# EasyEDA Pro project 台钳控制板.epro

# Schematic Schematic2
Create Date: 2024-07-13; Page Name: P1; Project Name: 台钳控制板; Schematic Name: Schematic2; Update Date: 2024-07-13; Company: 嘉立创EDA; Page Size: A4; Version: V1.0
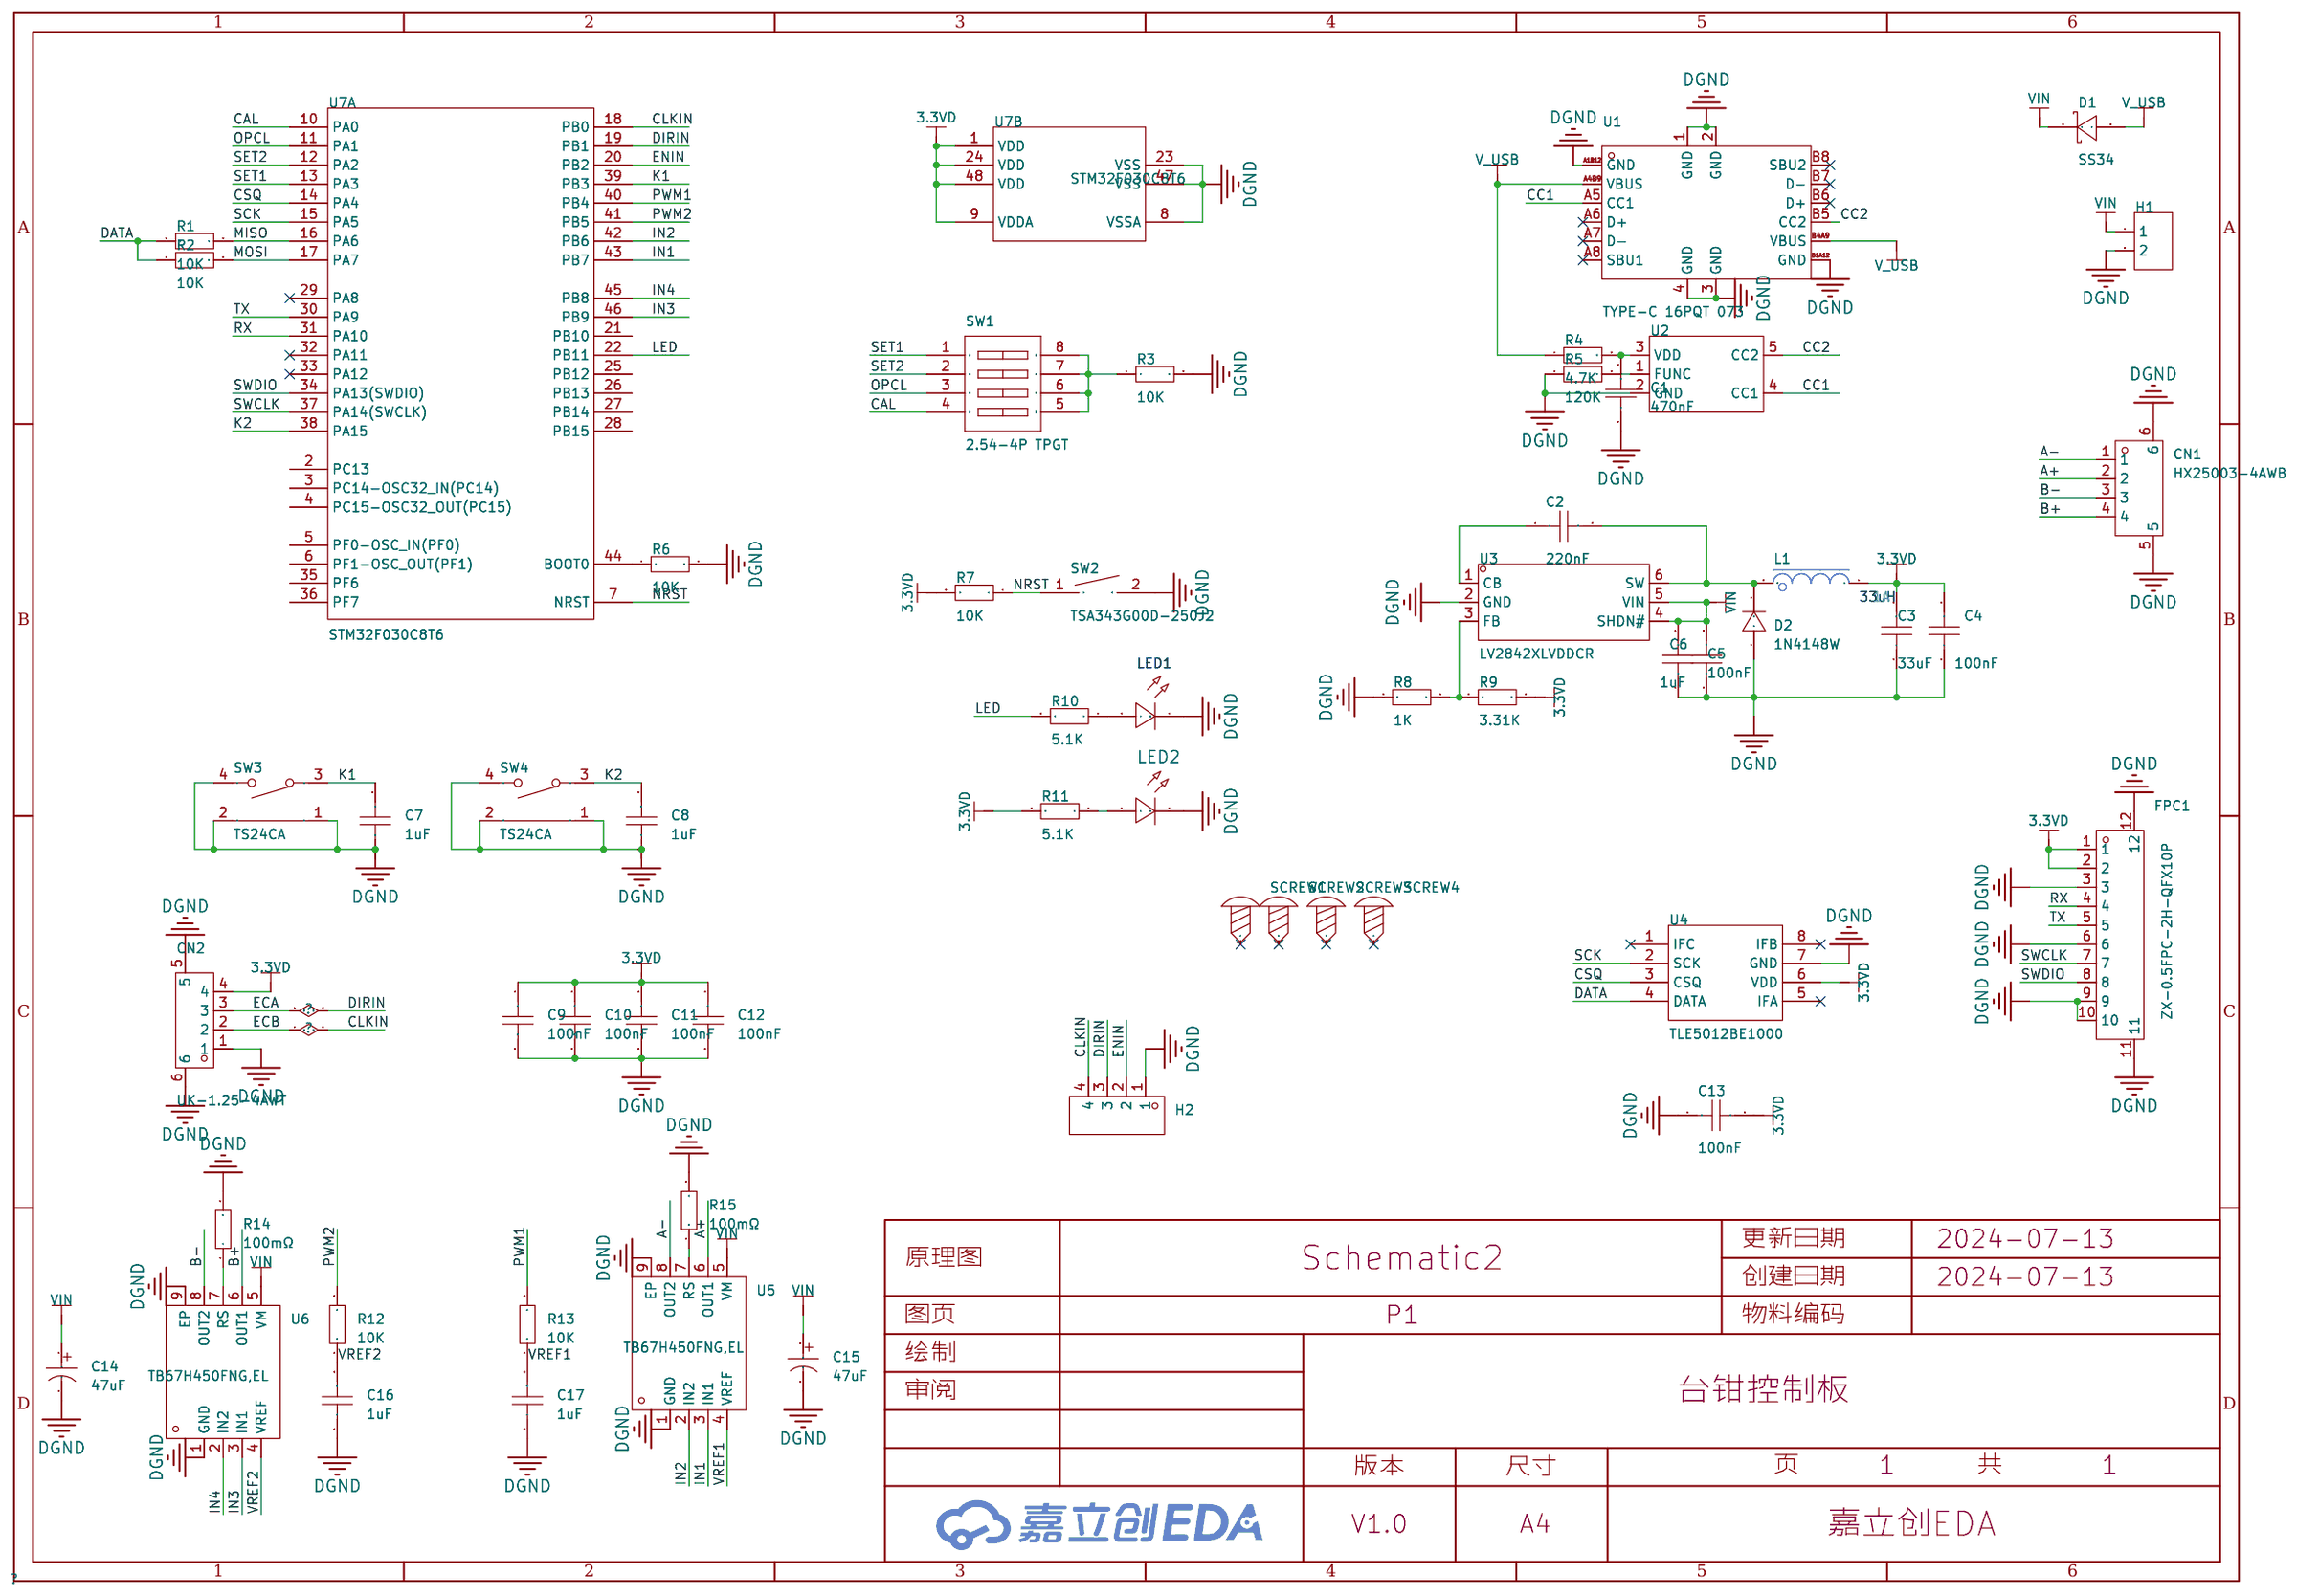
[diagram p0: schematic sheet]

## Parts
C1  470nF  [C0402]
C2  220nF  [C0402]
C3  33uF  [C0603]
C4  100nF  [C0402]
C5  100nF  [C0402]
C6  1uF  [C0603]
C7  1uF  [C0402]
C8  1uF  [C0402]
C9  100nF  [C0402]
C10  100nF  [C0402]
C11  100nF  [C0402]
C12  100nF  [C0402]
C13  100nF  [C0402]
C14  47uF  [CAP-SMD_BD6.3-L6.6-W6.6-FD]
C15  47uF  [CAP-SMD_BD6.3-L6.6-W6.6-FD]
C16  1uF  [C0402]
C17  1uF  [C0402]
CN1  HX25003-4AWB  [CONN-SMD_4P-P2.50_HX25003-4AWB]
CN2  UK-1.25-4AWT  [CONN-SMD_4P-P1.25-HC-1.25-4PWT]
D1  SS34  [SMA_L4.3-W2.6-LS5.2-RD]
D2  1N4148W  [SOD-123F_L2.7-W1.6-LS3.8-RD]
FPC1  ZX-0.5FPC-2H-QFX10P  [FPC-SMD_10P-P0.50_ZX-0.5FPC-2H-QFX10P]
H1  -  [HDR-TH_2P-P2.54-V-F]
H2  -  [HDR-TH_4P-P2.54-V-M]
L1  33uH  [SMD_L_4020]
LED1  -  [LED_0603]
LED2  -  [LED_0603]
R1  10K  [R0402]
R2  10K  [R0402]
R3  10K  [R0402]
R4  4.7K  [R0402]
R5  120K  [R0402]
R6  10K  [R0402]
R7  10K  [R0402]
R8  1K  [R0402]
R9  3.31K  [R0402]
R10  5.1K  [R0402]
R11  5.1K  [R0402]
R12  10K  [R0402]
R13  10K  [R0402]
R14  100mΩ  [R1206]
R15  100mΩ  [R1206]
SCREW1  -  [M3螺丝]
SCREW2  -  [M3螺丝]
SCREW3  -  [M3螺丝]
SCREW4  -  [M3螺丝]
SW1  2.54-4P TPGT  [SW-SMD_8P-L10.2-W6.2-P2.54-LS9.4]
SW2  TSA343G00D-250J2  [SW-SMD_L4.0-W2.9-P4.15-EH]
SW3  TS24CA  [SW-SMD_TS24CA]
SW4  TS24CA  [SW-SMD_TS24CA]
U1  TYPE-C 16PQT 073  [USB-SMD_TYPE-C-16PQT-073]
U2  fs312a  [SOT-23-5_L3.0-W1.7-P0.95-LS2.8-BL]
U3  LV2842XLVDDCR  [SOT-23-6_L2.9-W1.6-P0.95-LS2.8-BR]
U4  TLE5012BE1000  [PG-DSO-8_L5.0-W4.0-P1.27-LS6.0-BL]
U5  TB67H450FNG,EL  [HSOP-8_L5.0-W4.0-P1.27-LS6.2-BL-EP]
U6  TB67H450FNG,EL  [HSOP-8_L5.0-W4.0-P1.27-LS6.2-BL-EP]
U7  STM32F030C8T6  [LQFP-48_L7.0-W7.0-P0.50-LS9.0-BL]  (sections 1,2)

## Library data of the parts
C1 C5 C7-C12 C16 C17 = CAP_0402: Supplier Footprint: 0402
C2-C4 C6 C13 = CAP_0603: Supplier Footprint: 0603
C14 C15 = UWX1C101MCL1GB: 容值:100uF;精度:±20%;额定电压:16V;纹波电流:129mA@10kHz;等效串联电阻:-;; LCSC Part Name: 100uF ±20% 16V; Supplier Part: C111600; Manufacturer: Nichicon(尼吉康); Supplier Footprint: SMD,D6.3xL5.4mm; JLCPCB Part Class: 扩展库; Datasheet: https://atta.szlcsc.com/upload/public/pdf/source/20170511/1494500117761.pdf; Supplier: LCSC; Tolerance: ±20%; Rated Voltage: 16V; Ripple Current: 129mA@10kHz; Lifetime @ Temp: 2000hrs@85℃; Operating Temperature: -40℃~+85℃
CN1 = HX25003-4AWB: 插针结构:1x4P;间距:2.5mm;安装方式:卧贴;参考系列:XH;总PIN数:4P;排数:1;每排PIN数:4;行距:-;额定电流:-;工作温度范围:-;; LCSC Part Name: 1x4P 间距:2.5mm 卧贴 系列:XH; Supplier Part: C442363; Manufacturer: HX(红星); Supplier Footprint: SMD,P=2.5mm,卧贴; JLCPCB Part Class: 扩展库; Datasheet: https://atta.szlcsc.com/upload/public/pdf/source/20191028/C442367_BC69C0AF17F43F9554F3C8F10FEBE7E8.pdf; Supplier: LCSC; Pins Structure: 1x4P; Pitch: 2.5mm; Mounting Style: 卧贴; Reference Series: XH; Number of Pins: 4P; Number of Rows: 1; Number of PINs Per Row: 4
CN2 = UK-1.25-4AWT: 插针结构:1x4P;间距:1.25mm;安装方式:卧贴;总PIN数:4P;排数:1;每排PIN数:4;额定电流:1A;工作温度范围:-25℃~+85℃;; LCSC Part Name: 间距:1.25mm 卧贴; Supplier Part: C2997378; Manufacturer: USAKRO(美韩); Supplier Footprint: SMD,P=1.25mm,卧贴; JLCPCB Part Class: 扩展库; Datasheet: https://atta.szlcsc.com/upload/public/pdf/source/20220419/24A4256629D7E8D61BFE5BCA4B394246.pdf; Supplier: LCSC; Pins Structure: 1x4P; Pitch: 1.25mm; Mounting Style: 卧贴; Number of Pins: 4P; Number of Rows: 1; Number of PINs Per Row: 4; Current Rating (Max): 1A; Operating Temperature Range: -25℃~+85℃
D1 = SS34_C8678: 二极管配置:独立式;正向压降(Vf):550mV@3A;直流反向耐压(Vr):40V;整流电流:3A;; LCSC Part Name: 电压:40V 电流:3A; Supplier Part: C8678; Manufacturer: MDD(辰达半导体); Supplier Footprint: SMA(DO-214AC); JLCPCB Part Class: 基础库; Datasheet: https://atta.szlcsc.com/upload/public/pdf/source/20230314/A80AE34493C69B89E2F4B1712F433538.pdf; Supplier: LCSC; Diode Configuration: 独立式; Forward Voltage (Vf@If): 550mV@3A; Reverse Voltage (Vr): 40V; Rectified Current: 3A; Reverse Leakage Current (Ir): 500uA@40V
D2 = 1N4148W_C81598: 二极管配置:独立式;正向压降(Vf):1V@50mA;直流反向耐压(Vr):75V;平均整流电流(Io):150mA;功率:400mW;反向恢复时间(trr):4ns;; LCSC Part Name: 电压:75V 电流:150mA; Supplier Part: C81598; Manufacturer: ST(先科); Supplier Footprint: SOD-123; JLCPCB Part Class: 基础库; Datasheet: https://atta.szlcsc.com/upload/public/pdf/source/20161024/1477288446905.pdf; Supplier: LCSC; Diode Configuration: 独立式; Forward Voltage (Vf@If): 1V@50mA; Reverse Voltage (Vr): 75V; Average Rectified Current (Io): 150mA; Power Dissipation: 400mW; Reverse Leakage Current: 1uA@75V; Reverse Recovery Time (trr): 4ns
FPC1 = ZX-0.5FPC-2H-QFX10P: 锁定特性:翻盖式;触点类型:下接;触点数量:10P;间距:0.5mm;安装类型:卧贴;工作温度范围:-25℃~+85℃;焊接温度(最大值):260℃;; LCSC Part Name: 间距:0.5mm P数:10P 翻盖式 下接; Supplier Part: C19191099; Manufacturer: Megastar(兆星); Supplier Footprint: SMD,P=0.5mm,卧贴; JLCPCB Part Class: Extended Part; Datasheet: https://atta.szlcsc.com/upload/public/pdf/source/20231122/FDEF65B08E48FE17C134EB18CD9A6E22.pdf; Supplier: LCSC; Locking Feature: 翻盖式; Contact Type: 下接; Number of Contacts: 10P; Pitch: 0.5mm; Mounting Type: 卧贴; FFC, FCB Thickness: 0.3mm; Height Above Board: 2mm; Contact Material: 铜合金; Contact Plating: 锡; Operating Temperature Range: -25℃~+85℃; Soldering Temperature(Max): 260℃
H1 = HDR-F_2.54_1x2P: Supplier Part: C49661; Supplier Footprint: 插件
H2 = HDR-M_2.54_1x4P: Supplier Part: C492403; Supplier Footprint: 插件
L1 = L-4.7uH-1A: 4.7uH-1A-SNR4020B; 额定电流: 1A; Inductance: 4.7uH; 直流电阻（DCR）: 0.098Ω; 精度: ±20%; Datasheet: 新SWPA_series_of_SMD_Power_Inductor___奕锋泰; Part Code: L-SMD-4020-00002; Supplier Part: C7589004
LED1 = LED_0603-G: Supplier Footprint: 0603
LED2 = LED_0603-R: Supplier Footprint: 0603
R1 R2 = Res_0402: Supplier Footprint: 0402
R3-R13 = Res_0603: Supplier Footprint: 0603
R14 R15 = 1206W4F100LT5E: 电阻类型:厚膜电阻;阻值:100mΩ;精度:±1%;功率:250mW;最大工作电压:200V;温度系数:±800ppm/℃;; LCSC Part Name: 100mΩ ±1% 250mW 厚膜电阻; Supplier Part: C25334; Manufacturer: UNI-ROYAL(厚声); Supplier Footprint: 1206; JLCPCB Part Class: 基础库; Datasheet: https://atta.szlcsc.com/upload/public/pdf/source/20200306/C422600_1E6D84923E4A46A82E41ADD87F860B5C.pdf; Supplier: LCSC; Type: 厚膜电阻; Tolerance: ±1%; Power(Watts): 250mW; Overload Voltage (Max): 200V; Temperature Coefficient: ±800ppm/℃; Operating Temperature Range: -55℃~+155℃
SCREW1-SCREW4 = M3螺丝: Supplier Footprint: 插件
SW1 = 2.54-4P TPGT: 类型:平拨,凸起式;电路结构:单刀单掷;开关位数:4位;额定电流:25mA;额定电压:24V;使用寿命:3千次;颜色:黑色;; LCSC Part Name: 间距2.54mm 4位高推 拨码开关 贴片; Supplier Part: C6331176; Manufacturer: SHOU HAN(首韩); Supplier Footprint: SMD; JLCPCB Part Class: 扩展库; Datasheet: https://atta.szlcsc.com/upload/public/pdf/source/20240424/C829D75C35A7F665042EE0237C58A657.pdf; Supplier: LCSC; Type: 平拨,凸起式; Circuit: 单刀单掷; Number of Positions: 4位; Lead Pitch: 2.54mm; Current Rating: 25mA; Voltage Rating: 24V; Operating Life: 3千次; Color: 黑色
SW2 = TSA343G00D-250J2: 电路结构:单刀单掷;按钮形状:圆形按钮;作用力:250gf;安装方式:立贴;开关长度:4mm;开关宽度:3mm;开关高度:2mm;带支架:不带;触点电流:50mA;额定电压(DC):12V;绝缘电阻:100MΩ;带灯:无;机械寿命:5万次;; LCSC Part Name: 4*3*2mm 立贴 轻触开关; Supplier Part: C354947; Manufacturer: BRIGHT(博瑞泰); Supplier Footprint: SMD; JLCPCB Part Class: 扩展库; Datasheet: https://atta.szlcsc.com/upload/public/pdf/source/20190426/C354947_F1C4B323DD8D3B81255E73F8FD6ABFD3.pdf; Supplier: LCSC; Circuit: 单刀单掷; Actuator Style: 圆形按钮; Operating Force: 250gf; Mounting Style: 立贴; Switch Length: 4mm; Switch Width: 3mm; Switch Height: 2mm; Strike Gundam: 不带; Contact Current: 50mA; Voltage Rating (DC): 12V; Insulation Resistance: 100MΩ; Actuator/Cap Color: 黑色; With Lamp: 无; Pin Style: SMD接片; Mechanical Life: 5万次; Operating Temperature: -25℃~+70℃
SW3 SW4 = TS24CA: 电路结构:单刀单掷;按钮形状:矩形按钮;安装方式:卧贴;开关长度:4.55mm;开关宽度:1.8mm;开关高度:3.5mm;触点电流:50mA;额定电压(DC):12V;带灯:-;机械寿命:-;; LCSC Part Name: 4.55*1.8*3.5mm 卧贴 轻触开关; Supplier Part: C393942; Manufacturer: SHOU HAN(首韩); Supplier Footprint: SMD; JLCPCB Part Class: 扩展库; Datasheet: https://atta.szlcsc.com/upload/public/pdf/source/20190521/C393942_591A9E318887EFA4274D34029981AD99.pdf; Supplier: LCSC; Circuit: 单刀单掷; Actuator Style: 矩形按钮; Mounting Style: 卧贴; Switch Length: 4.55mm; Switch Width: 1.8mm; Switch Height: 3.5mm; Contact Current: 50mA; Voltage Rating (DC): 12V
U1 = TYPE-C 16PQT 073: 连接器类型:Type-C;标准:-;公母:母;端口数量:1;触点数量:16P;安装方式:卧贴;额定电流 - 电源:3A;触头材质:-;触头镀层:-;工作温度范围:-25℃~+85℃;; LCSC Part Name: Type-C 母 卧贴; Supplier Part: C5156603; Manufacturer: SHOU HAN(首韩); Supplier Footprint: SMD; JLCPCB Part Class: 扩展库; Datasheet: https://atta.szlcsc.com/upload/public/pdf/source/20220905/90688BCC0A20F79F4C7CA977EA1B0A11.pdf; Supplier: LCSC; Connector Type: Type-C; Gender: 母; Number of Ports: 1; Number of Contacts: 16P; Mounting Style: 卧贴; Current Rating - Power (Max): 3A; Operating Temperature Range: -25℃~+85℃
U2 = FS312A: Supplier: LCSC; Supplier Part: C9900044546; Supplier Footprint: SOT23-5; Datasheet: http://43.138.174.208/wp-content/uploads/2022/11/%E9%80%9F%E8%8A%AF%E5%BE%AE%E7%94%B5%E5%AD%90FS312A%E6%95%B0%E6%8D%AE%E6%89%8B%E5%86%8C-v1.2%EF%BC%882022.11.7%EF%BC%89.pdf
U3 = LV2842XLVDDCR: 功能类型:降压型;输入电压:-;输出电流(最大值):-;; Supplier Part: C225807; Manufacturer: TI(德州仪器); Supplier Footprint: SOT-23-6; JLCPCB Part Class: 扩展库; Datasheet: https://atta.szlcsc.com/upload/public/pdf/source/20180820/C225807_86EBD6310E0F8BF9D1D4E9854A4EDCFD.pdf; Supplier: LCSC; Function: 降压型; Switch tube (built-in/external): 内置
U4 = TLE5012BE1000: 旋转角度范围:0°~360°;; Supplier Part: C123083; Manufacturer: Infineon(英飞凌); Supplier Footprint: SO-8; JLCPCB Part Class: 扩展库; Datasheet: https://atta.szlcsc.com/upload/public/pdf/source/20170728/C123083_1501225763065848823.pdf; Supplier: LCSC; Rotation Angle: 0°~360°
U5 U6 = TB67H450FNG,EL: Supplier Part: C545417; Manufacturer: TOSHIBA(东芝); Supplier Footprint: SOIC-8; JLCPCB Part Class: 扩展库; Datasheet: https://atta.szlcsc.com/upload/public/pdf/source/20211227/C3DC112555A020FEF41243C8668D1DC3.pdf; Supplier: LCSC
U7 = STM32F030C8T6: CPU内核:CM0;程序存储容量:64KB;RAM总容量:8KB;GPIO端口数量:39;工作电压范围:2.4V~3.6V;CPU最大主频:48MHz;程序存储器类型:FLASH;; LCSC Part Name: 基于ARM®的32位MCU，具有高达256KB的闪存，定时器，ADC，通信接口，2.4V-3.6V操作; Supplier Part: C23922; Manufacturer: ST(意法半导体); Supplier Footprint: LQFP-48(7x7); JLCPCB Part Class: 扩展库; Datasheet: https://atta.szlcsc.com/upload/public/pdf/source/20150124/1457707258011.pdf; Supplier: LCSC; CPU Core: CM0; Program Storage Size: 64KB; RAM Size: 8KB; GPIO Ports Number: 39; Operating Voltage Range: 2.4V~3.6V; CPU Maximum Speed: 48MHz; Program Memory Type: FLASH; Operating Temperature Range: -40℃~+85℃; ADC (Bit): 12bit; Watchdog: 有; Low-Voltage Detect: 有; Direct Memory Access: 有; Internal Oscillator: 有

## Nets
3.3VD: C3.2 C4.2 C9.1 C10.1 C11.1 C12.1 C13.2 CN2.4 FPC1.1 FPC1.2 L1.1 R7.2 R9.1 R11.2 U4.6(VDD) U7.1(VDD) U7.9(VDDA) U7.24(VDD) U7.48(VDD)
DGND: C1.1 C3.1 C4.1 C5.1 C6.1 C7.1 C8.1 C9.2 C10.2 C11.2 C12.2 C13.1 C14.2 C15.2 C16.1 C17.1 CN1.5 CN1.6 CN2.1 CN2.5 CN2.6 D2.2(A) FPC1.3 FPC1.6 FPC1.9 FPC1.10 FPC1.11 FPC1.12 H1.2 H2.1 LED1.1(C) LED2.1(C) R3.2 R5.1 R6.2 R8.2 R14.2 R15.2 SW2.2 SW3.1 SW3.2 SW3.4 SW4.1 SW4.2 SW4.4 U1.1(GND) U1.2(GND) U1.3(GND) U1.4(GND) U1.A1B12(GND) U1.B1A12(GND) U2.2(GND) U3.2(GND) U4.7(GND) U5.1(GND) U5.9(EP) U6.1(GND) U6.9(EP) U7.8(VSSA) U7.23(VSS) U7.47(VSS)
VIN: C5.2 C6.2 C14.1 C15.1 D1.1(K) H1.1 U3.4(SHDN#) U3.5(VIN) U5.5(VM) U6.5(VM)
A+: CN1.2 U5.6(OUT1)
A-: CN1.1 U5.8(OUT2)
B+: CN1.4 U6.6(OUT1)
B-: CN1.3 U6.8(OUT2)
CAL: SW1.4(A4) U7.10(PA0)
CC1: U1.A5(CC1) U2.4(CC1)
CC2: U1.B5(CC2) U2.5(CC2)
CLKIN: CN2.2 H2.4 U7.18(PB0)
CSQ: U4.3(CSQ) U7.14(PA4)
DATA: R1.1 R2.1 U4.4(DATA)
DIRIN: CN2.3 H2.3 U7.19(PB1)
ENIN: H2.2 U7.20(PB2)
IN1: U5.3(IN1) U7.43(PB7)
IN2: U5.2(IN2) U7.42(PB6)
IN3: U6.3(IN1) U7.46(PB9)
IN4: U6.2(IN2) U7.45(PB8)
K1: C7.2 SW3.3 U7.39(PB3)
K2: C8.2 SW4.3 U7.38(PA15)
LED: R10.2 U7.22(PB11)
MISO: R1.2 U7.16(PA6)
MOSI: R2.2 U7.17(PA7)
NRST: R7.1 SW2.1 U7.7(NRST)
OPCL: SW1.3(A3) U7.11(PA1)
PWM1: R13.2 U7.40(PB4)
PWM2: R12.2 U7.41(PB5)
RX: FPC1.4 U7.31(PA10)
SCK: U4.2(SCK) U7.15(PA5)
SET1: SW1.1(A1) U7.13(PA3)
SET2: SW1.2(A2) U7.12(PA2)
SWCLK: FPC1.7 U7.37(PA14(SWCLK))
SWDIO: FPC1.8 U7.34(PA13(SWDIO))
TX: FPC1.5 U7.30(PA9)
V_USB: D1.2(A) R4.1 U1.A4B9(VBUS) U1.B4A9(VBUS)
VREF1: C17.2 R13.1 U5.4(VREF)
VREF2: C16.2 R12.1 U6.4(VREF)
$1N1812: R6.1 U7.44(BOOT0)
$1N2583: R3.1 SW1.5(B4) SW1.6(B3) SW1.7(B2) SW1.8(B1)
$1N3189: C1.2 R4.2 U2.3(VDD)
$1N3458: R5.2 U2.1(FUNC)
$1N3955: C2.1 U3.1(CB)
$1N3959: C2.2 D2.1(K) L1.2 U3.6(SW)
$1N4403: R8.1 R9.2 U3.3(FB)
$1N5172: LED2.2(A) R11.1
$1N5198: LED1.2(A) R10.1
$1N7717: R14.1 U6.7(RS)
$1N7720: R15.1 U5.7(RS)

Not connected (* = marked no-connect by the designer): SCREW1 1*; SCREW2 1*; SCREW3 1*; SCREW4 1*; U1 A6(D+)* A7(D-)* A8(SBU1)* B6(D+)* B7(D-)* B8(SBU2)*; U4 1(IFC)* 5(IFA)* 8(IFB)*; U7 2(PC13) 3(PC14-OSC32_IN(PC14)) 4(PC15-OSC32_OUT(PC15)) 5(PF0-OSC_IN(PF0)) 6(PF1-OSC_OUT(PF1)) 21(PB10) 25(PB12) 26(PB13) 27(PB14) 28(PB15) 29(PA8)* 32(PA11)* 33(PA12)* 35(PF6) 36(PF7)

# Schematic Schematic1
Create Date: 2024-04-29; Page Name: P1; Project Name: 台钳控制板; Schematic Name: Schematic1; Update Date: 2024-04-29; Company: 嘉立创EDA; Page Size: A4; Version: V1.0
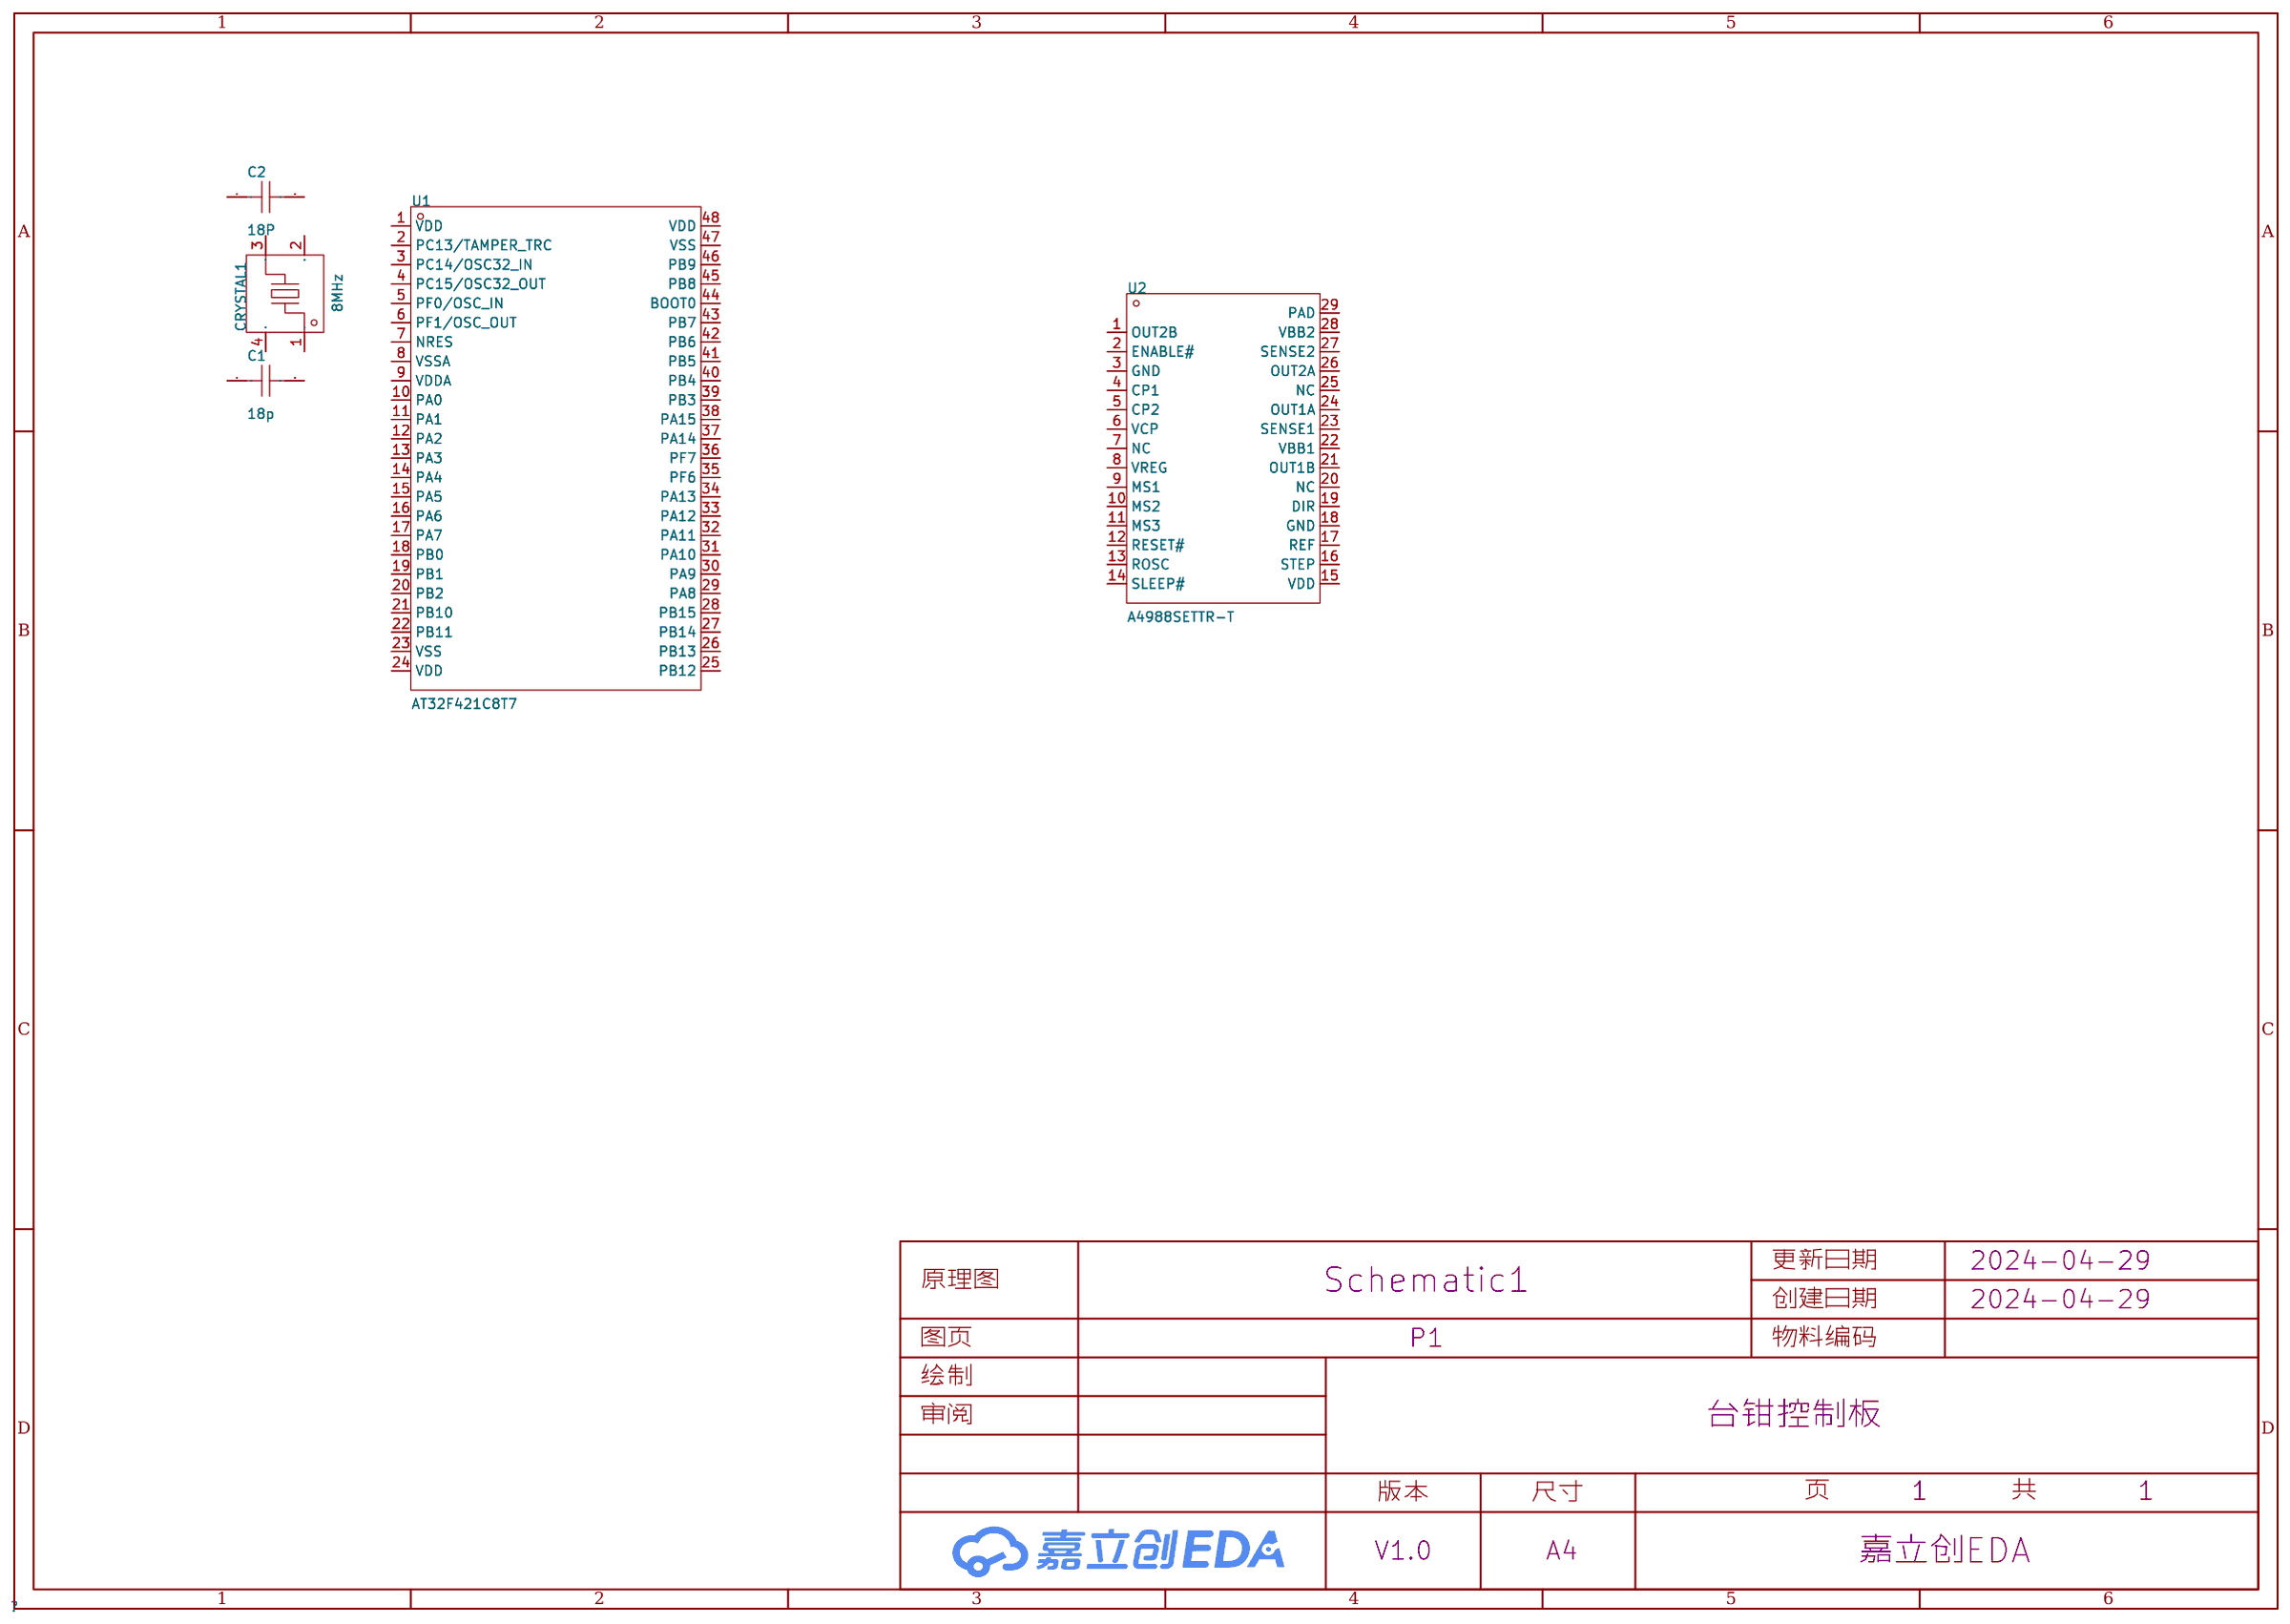
[diagram p1: schematic sheet]

## Parts
C1  18p  [C0603]
C2  18P  [C0603]
CRYSTAL1  8MHz  [CRYSTAL-SMD_4P-L3.2-W2.5-BL_SIT8008BI]
U1  AT32F421C8T7  [LQFP-48_L7.0-W7.0-P0.50-LS9.0-BL]
U2  A4988SETTR-T  [WQFN-28_L5.0-W5.0-P0.50-BL-EP3.2]

## Library data of the parts
C1 C2 = CAP_0603: Supplier Footprint: 0603
CRYSTAL1 = CF4008M00012001: 晶振类型:贴片晶振;频率:8MHz;常温频差:±10ppm;外接负载电容:12pF;频率稳定度(全温):±30ppm;; LCSC Part Name: 8MHz ±10ppm 12pF; Supplier Part: C7294546; Manufacturer: HUAXIN(华昕); Supplier Footprint: SMD-3225-4P; JLCPCB Part Class: 扩展库; Datasheet: https://atta.szlcsc.com/upload/public/pdf/source/20230614/403FD538918E19EFAFACD07D4A487DFF.pdf; Supplier: LCSC; Crystal Type: 贴片晶振; Normal temperature Frequency Tolerance: ±10ppm; External load capacitor: 12pF; Frequency Stability(Full temperature range): ±30ppm; Equivalent Series Resistance (ESR): 40Ω; Operating Temperature: -40℃~+85℃
U1 = AT32F421C8T7: CPU内核:CM4;程序存储容量:64KB;RAM总容量:16KB;GPIO端口数量:-;工作电压范围:-;CPU最大主频:-;程序存储器类型:FLASH;; Supplier Part: C2687447; Manufacturer: ARTERY(雅特力); Supplier Footprint: LQFP-48(7x7); JLCPCB Part Class: 扩展库; Datasheet: https://atta.szlcsc.com/upload/public/pdf/source/20210622/C2765098_2C72C7B1BCEA7473D7B0BCEAEE10BC9B.pdf; Supplier: LCSC; CPU Core: CM4; Program Storage Size: 64KB; RAM Size: 16KB; Program Memory Type: FLASH; Internal Oscillator: 有
U2 = A4988SETTR-T: 驱动电机类型:-;电源电压:3V~5.5V;输出电流:2A;接口:-;; LCSC Part Name: 2A 5.5V电机驱动芯片; Supplier Part: C38437; Manufacturer: ALLEGRO(美国埃戈罗); Supplier Footprint: WQFN-28-EP(5x5); JLCPCB Part Class: 扩展库; Datasheet: https://atta.szlcsc.com/upload/public/pdf/source/20150917/1457707386953.pdf; Supplier: LCSC; Supply Voltage: 3V~5.5V; Output Current: 2A; Operating Temperature: -20℃~+150℃@(Tj)

## Nets

Not connected (* = marked no-connect by the designer): C1 1 2; C2 1 2; CRYSTAL1 1 2(GND) 3 4(GND); U1 1(VDD) 2(PC13/TAMPER_TRC) 3(PC14/OSC32_IN) 4(PC15/OSC32_OUT) 5(PF0/OSC_IN) 6(PF1/OSC_OUT) 7(NRES) 8(VSSA) 9(VDDA) 10(PA0) 11(PA1) 12(PA2) 13(PA3) 14(PA4) 15(PA5) 16(PA6) 17(PA7) 18(PB0) 19(PB1) 20(PB2) 21(PB10) 22(PB11) 23(VSS) 24(VDD) 25(PB12) 26(PB13) 27(PB14) 28(PB15) 29(PA8) 30(PA9) 31(PA10) 32(PA11) 33(PA12) 34(PA13) 35(PF6) 36(PF7) 37(PA14) 38(PA15) 39(PB3) 40(PB4) 41(PB5) 42(PB6) 43(PB7) 44(BOOT0) 45(PB8) 46(PB9) 47(VSS) 48(VDD); U2 1(OUT2B) 2(ENABLE#) 3(GND) 4(CP1) 5(CP2) 6(VCP) 7(NC) 8(VREG) 9(MS1) 10(MS2) 11(MS3) 12(RESET#) 13(ROSC) 14(SLEEP#) 15(VDD) 16(STEP) 17(REF) 18(GND) 19(DIR) 20(NC) 21(OUT1B) 22(VBB1) 23(SENSE1) 24(OUT1A) 25(NC) 26(OUT2A) 27(SENSE2) 28(VBB2) 29(PAD)

# Board PCB1
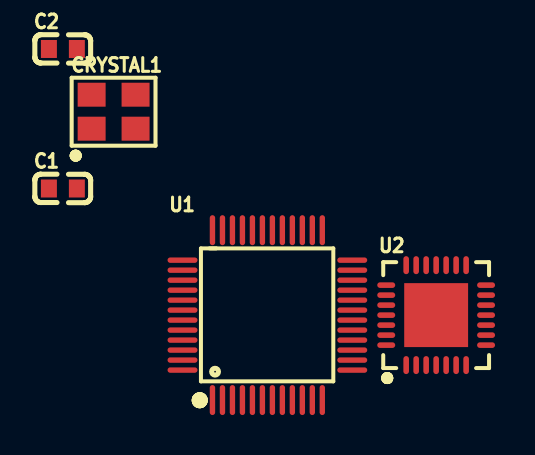
[diagram p2: board, top side]
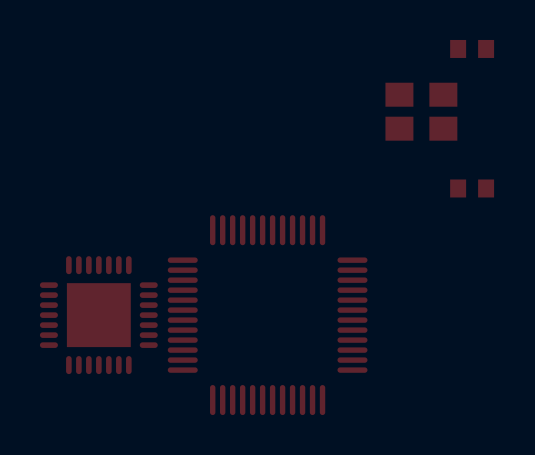
[diagram p3: board, bottom side, seen from below]

No outline. copper layers: Top Layer, Bottom Layer. Coordinates in mm from the lowest, leftmost part position.
Stack: Top Layer 0.035mm / Dielectric1 1.51mm FR4 er 4.5 / Bottom Layer 0.035mm

## Design rules (mm)
template: JLCPCB Capability(Two Layers Board)
spacing copperThickness1oz (default): track to track 0.102, other pairs 0.152 to 0.3
spacing copperThickness2oz: track to track 0.203, other pairs 0.152 to 0.3
track width copperThickness1oz (default): min 0.127, default 0.254, max 2.54
track width copperThickness2oz: min 0.203, default 0.254, max 2.54
differential pair differentialPair (default): width min 0.127, default 0.254, max 2.54; gap min 0.152, default 0.152
via viaSize (default): diameter min 0.5, default 0.61, max 10; hole min 0.3, default 0.305, max 6.3

## Placement (name value [footprint] x y rotation side)
C1  18p  [C0603]  0 6.34 0 top
C2  18P  [C0603]  0 13.32 0 top
CRYSTAL1  8MHz  [CRYSTAL-SMD_4P-L3.2-W2.5-BL_SIT8008BI]  2.54 10.18 0 top
U1  AT32F421C8T7  [LQFP-48_L7.0-W7.0-P0.50-LS9.0-BL]  10.24 0 0 top
U2  A4988SETTR-T  [WQFN-28_L5.0-W5.0-P0.50-BL-EP3.2]  18.69 0 0 top

## Footprints (pads in the part's own frame, mm; a bottom-side part is the same pattern mirrored in y, then rotated)
C0603
  rect 0.8x0.9 smd: 1(-0.7,0) 2(0.7,0)
CRYSTAL-SMD_4P-L3.2-W2.5-BL_SIT8008BI
  rect 1.4x1.2 smd: 1(-1.1,-0.85) 2(1.1,-0.85) 3(1.1,0.85) 4(-1.1,0.85)
LQFP-48_L7.0-W7.0-P0.50-LS9.0-BL
  oval 0.27x1.5 smd: 1(-2.75,-4.25) 2(-2.25,-4.25) 3(-1.75,-4.25) 4(-1.25,-4.25) 5(-0.75,-4.25) 6(-0.25,-4.25) 7(0.25,-4.25) 8(0.75,-4.25) 9(1.25,-4.25) 10(1.75,-4.25) 11(2.25,-4.25) 12(2.75,-4.25) 25(2.75,4.25) 26(2.25,4.25) 27(1.75,4.25) 28(1.25,4.25) 29(0.75,4.25) 30(0.25,4.25) 31(-0.25,4.25) 32(-0.75,4.25) 33(-1.25,4.25) 34(-1.75,4.25) 35(-2.25,4.25) 36(-2.75,4.25)
  oval 1.5x0.27 smd: 13(4.25,-2.75) 14(4.25,-2.25) 15(4.25,-1.75) 16(4.25,-1.25) 17(4.25,-0.75) 18(4.25,-0.25) 19(4.25,0.25) 20(4.25,0.75) 21(4.25,1.25) 22(4.25,1.75) 23(4.25,2.25) 24(4.25,2.75) 37(-4.25,2.75) 38(-4.25,2.25) 39(-4.25,1.75) 40(-4.25,1.25) 41(-4.25,0.75) 42(-4.25,0.25) 43(-4.25,-0.25) 44(-4.25,-0.75) 45(-4.25,-1.25) 46(-4.25,-1.75) 47(-4.25,-2.25) 48(-4.25,-2.75)
WQFN-28_L5.0-W5.0-P0.50-BL-EP3.2
  oval 0.28x0.9 smd: 1(-1.502,-2.5) 2(-1.001,-2.5) 3(-0.5,-2.5) 4(0,-2.5) 5(0.5,-2.5) 6(1,-2.5) 7(1.501,-2.5) 15(1.501,2.5) 16(1,2.5) 17(0.5,2.5) 18(0,2.5) 19(-0.5,2.5) 20(-1.001,2.5) 21(-1.502,2.5)
  oval 0.9x0.28 smd: 8(2.5,-1.502) 9(2.5,-1.001) 10(2.5,-0.5) 11(2.5,0) 12(2.5,0.5) 13(2.5,1) 14(2.5,1.501) 22(-2.5,1.501) 23(-2.5,1) 24(-2.5,0.5) 25(-2.5,0) 26(-2.5,-0.5) 27(-2.5,-1.001) 28(-2.5,-1.502)
  rect 3.2x3.2 smd: 29(0,0)

## Nets
As in the schematic.

Pads without a net: C1 1 2; C2 1 2; CRYSTAL1 1 2 3 4; U1 1 2 3 4 5 6 7 8 9 10 11 12 13 14 15 16 17 18 19 20 21 22 23 24 25 26 27 28 29 30 31 32 33 34 35 36 37 38 39 40 41 42 43 44 45 46 47 48; U2 1 2 3 4 5 6 7 8 9 10 11 12 13 14 15 16 17 18 19 20 21 22 23 24 25 26 27 28 29

# Board PCB2
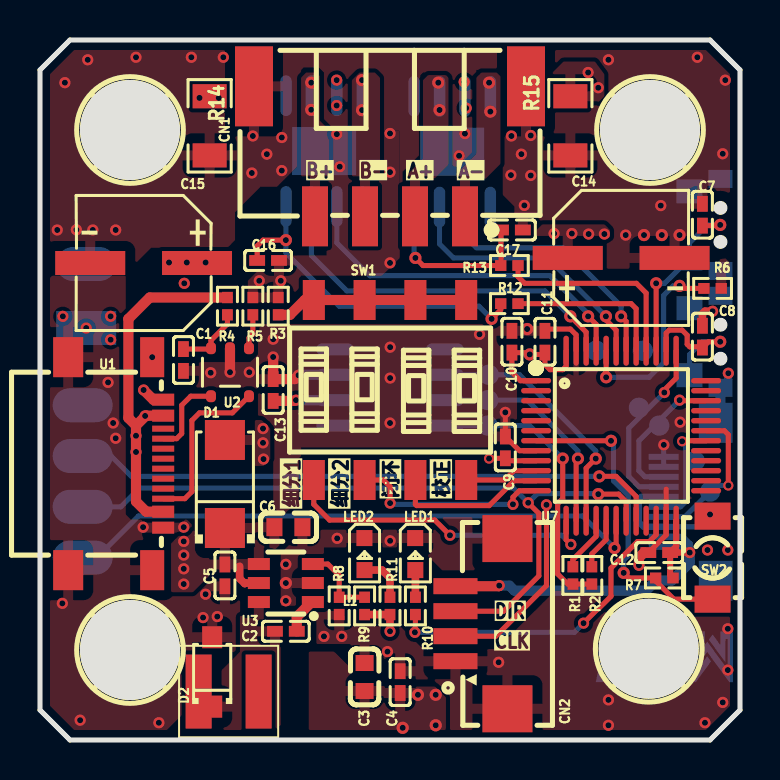
[diagram p4: board, top side]
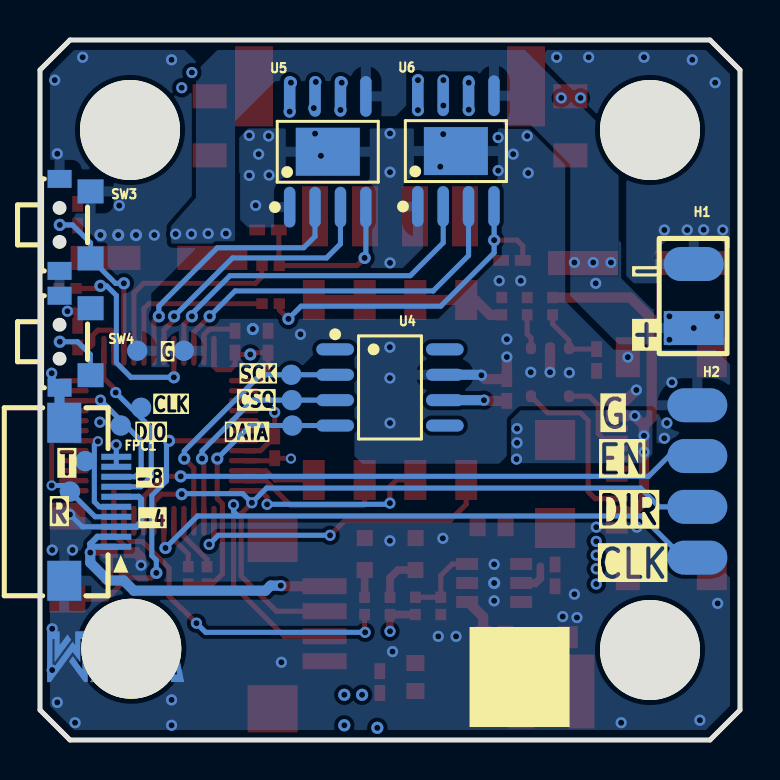
[diagram p5: board, bottom side, seen from below]

Outline 35 x 35 mm; copper layers: Top Layer, Inner1, Inner2, Bottom Layer. Coordinates in mm from the lower left corner of the outline.
Outline path: 0,33.5 0,1.5 1.5,0 33.5,0 35,1.5 35,33.5 33.5,35 1.5,35 0,33.5
Stack: Top Layer 0.035mm 外层铜厚1oz / Dielectric1 0.2104mm 7628 RC49% 8.6mil / Inner1 0.0152mm 内层铜厚 / Dielectric2 1.065mm 1.1mm H/HOZ 含铜 / Inner2 0.0152mm 内层铜厚 / Dielectric3 0.2104mm 7628 RC49% 8.6mil / Bottom Layer 0.035mm 外层铜厚1oz

## Design rules (mm)
template: 自定义配置
spacing copperThickness1oz (default): track to track 0.102, other pairs 0.152 to 0.3
spacing copperThickness2oz: track to track 0.203, other pairs 0.152 to 0.3
track width copperThickness1oz (default): min 0.127, default 0.254, max 2.54
track width copperThickness2oz: min 0.203, default 0.254, max 2.54
differential pair differentialPair (default): width min 0.127, default 0.254, max 2.54; gap min 0.152, default 0.152
via viaSize (default): diameter min 0.5, default 0.61, max 10; hole min 0.3, default 0.305, max 6.3
pour e205 uses 全连接
pour e699 uses 全连接
pour e704 uses 全连接
pour e711 uses 全连接
pour e713 uses 全连接
pour e2061 uses 全连接
pour e2079 uses 全连接

## Placement (name value [footprint] x y rotation side)
C1  470nF  [C0402]  7.17 19 90 top
C2  220nF  [C0402]  12.29 5.44 180 top
C3  33uF  [C0603]  16.23 3.15 270 top
C4  100nF  [C0402]  18.01 2.89 270 top
C5  100nF  [C0402]  9.25 8.23 90 top
C6  1uF  [C0603]  12.42 10.64 180 top
C7  1uF  [C0402]  33.12 26.26 270 top
C8  1uF  [C0402]  33.12 20.17 270 top
C9  100nF  [C0402]  23.27 14.63 90 top
C10  100nF  [C0402]  23.6 19.91 90 top
C11  100nF  [C0402]  25.25 19.91 90 top
C12  100nF  [C0402]  30.96 9.37 180 top
C13  100nF  [C0402]  11.66 17.5 270 top
C14  47uF  [CAP-SMD_BD6.3-L6.6-W6.6-FD]  29.06 24.1 0 top
C15  47uF  [CAP-SMD_BD6.3-L6.6-W6.6-FD]  5.18 23.85 180 top
C16  1uF  [C0402]  11.4 23.98 180 top
C17  1uF  [C0402]  23.6 25.5 180 top
CN1  HX25003-4AWB  [CONN-SMD_4P-P2.50_HX25003-4AWB]  17.5 29.18 180 top
CN2  UK-1.25-4AWT  [CONN-SMD_4P-P1.25-HC-1.25-4PWT]  22.07 5.82 90 top
D1  SS34  [SMA_L4.3-W2.6-LS5.2-RD]  9.25 12.8 90 top
D2  1N4148W  [SOD-123F_L2.7-W1.6-LS3.8-RD]  8.61 3.4 90 top
FPC1  ZX-0.5FPC-2H-QFX10P  [FPC-SMD_10P-P0.50_ZX-0.5FPC-2H-QFX10P]  32.49 11.91 270 bottom
H1  -  [HDR-TH_2P-P2.54-V-F]  2.31 22.2 90 bottom
H2  -  [HDR-TH_4P-P2.54-V-M]  2.13 12.93 270 bottom
L1  33uH  [SMD_L_4020]  12.55 2.51 180 top
LED1  -  [LED_0603]  18.77 9.25 270 top
LED2  -  [LED_0603]  16.23 9.25 270 top
NOREF  -  [Pad_e5786]  22.39 15.72 0 top
NOREF#2  -  [Pad_e5728]  30.96 15.72 0 top
NOREF#3  -  [Pad_e5845]  32.74 13.94 0 top
NOREF#4  -  [Pad_e5783]  22.41 16.99 0 top
NOREF#5  -  [Pad_e5842]  33.5 12.42 0 top
NOREF#6  -  [Pad_e5969]  30.14 19.46 0 top
NOREF#7  -  [Pad_e5726]  29.95 16.61 0 top
NOREF#8  -  [Pad_e5780]  22.44 18.26 0 top
NOREF#9  -  [Pad_e5839]  27.81 19.46 0 top
R1  10K  [R0402]  26.64 8.23 90 top
R2  10K  [R0402]  27.59 8.23 90 top
R3  10K  [R0402]  11.91 21.69 90 top
R4  4.7K  [R0402]  9.37 21.69 270 top
R5  120K  [R0402]  10.64 21.69 270 top
R6  10K  [R0402]  33.63 22.58 0 top
R7  10K  [R0402]  31.22 8.1 0 top
R8  1K  [R0402]  14.96 6.7 270 top
R9  3.31K  [R0402]  16.23 6.7 90 top
R10  5.1K  [R0402]  18.77 6.7 270 top
R11  5.1K  [R0402]  17.5 6.7 270 top
R12  10K  [R0402]  23.47 21.82 0 top
R13  10K  [R0402]  23.47 23.72 0 top
R14  100mΩ  [R1206]  8.48 30.71 270 top
R15  100mΩ  [R1206]  26.52 30.71 270 top
SCREW1  -  [M3螺丝]  30.5 4.5 0 top
SCREW2  -  [M3螺丝]  4.56 4.44 0 top
SCREW3  -  [M3螺丝]  30.56 30.44 0 top
SCREW4  -  [M3螺丝]  4.56 30.44 0 top
SW1  2.54-4P TPGT  [SW-SMD_8P-L10.2-W6.2-P2.54-LS9.4]  17.5 17.5 90 top
SW2  TSA343G00D-250J2  [SW-SMD_L4.0-W2.9-P4.15-EH]  33.63 9.12 90 top
SW3  TS24CA  [SW-SMD_TS24CA]  33.25 25.75 90 bottom
SW4  TS24CA  [SW-SMD_TS24CA]  33.25 19.91 90 bottom
U1  TYPE-C 16PQT 073  [USB-SMD_TYPE-C-16PQT-073]  3.78 13.82 270 top
U2  fs312a  [SOT-23-5_L3.0-W1.7-P0.95-LS2.8-BL]  9.5 18.39 180 top
U3  LV2842XLVDDCR  [SOT-23-6_L2.9-W1.6-P0.95-LS2.8-BR]  12.29 7.85 0 top
U4  TLE5012BE1000  [PG-DSO-8_L5.0-W4.0-P1.27-LS6.0-BL]  17.5 17.63 270 bottom
U5  TB67H450FNG,EL  [HSOP-8_L5.0-W4.0-P1.27-LS6.2-BL-EP]  20.61 29.41 180 bottom
U6  TB67H450FNG,EL  [HSOP-8_L5.0-W4.0-P1.27-LS6.2-BL-EP]  14.21 29.45 180 bottom
U7  STM32F030C8T6  [LQFP-48_L7.0-W7.0-P0.50-LS9.0-BL]  29.06 15.21 270 top
U7#2  -  [JLC-QRCODE-5x5]  11.02 3.15 180 bottom

## Footprints (pads in the part's own frame, mm; a bottom-side part is the same pattern mirrored in y, then rotated)
C0402
  rect 0.79x0.54 smd: 1(-0.545,0) 2(0.545,0)
C0603
  rect 0.8x0.9 smd: 1(-0.7,0) 2(0.7,0)
CAP-SMD_BD6.3-L6.6-W6.6-FD
  rect 3.5x1.2 smd: 1(-2.67,0) 2(2.67,0)
CONN-SMD_4P-P1.25-HC-1.25-4PWT
  rect 0.8x2.2 smd: 1(-1.875,1.3) 2(-0.625,1.3) 3(0.625,1.3) 4(1.875,1.3)
  rect 2.35x2.5 smd: 5(4.255,-1.3) 6(-4.255,-1.3)
CONN-SMD_4P-P2.50_HX25003-4AWB
  rect 1.3x3 smd: 1(-3.75,3) 2(-1.25,3) 3(1.25,3) 4(3.75,3)
  rect 1.9x4 smd: 5(6.8,-3.5) 6(-6.8,-3.5)
FPC-SMD_10P-P0.50_ZX-0.5FPC-2H-QFX10P
  rect 0.3x1.5 smd: 1(2.25,1.3) 2(1.75,1.3) 3(1.25,1.3) 4(0.75,1.3) 5(0.25,1.3) 6(-0.25,1.3) 7(-0.75,1.3) 8(-1.25,1.3) 9(-1.75,1.3) 10(-2.25,1.3)
  rect 2x1.7 smd: 11(-3.95,-1.3) 12(3.95,-1.3)
HDR-TH_2P-P2.54-V-F
  rect 1.7x3 smd: 1(-1.6,0)
  oval 1.7x3 smd: 2(1.6,0)
HDR-TH_4P-P2.54-V-M
  oval 1.7x3 smd: 1(-3.81,0) 2(-1.27,0) 3(1.27,0) 4(3.81,0)
HSOP-8_L5.0-W4.0-P1.27-LS6.2-BL-EP
  oval 0.574x2.038 smd: 1(-1.905,-2.769) 2(-0.635,-2.769) 3(0.635,-2.769) 4(1.905,-2.769) 5(1.905,2.769) 6(0.635,2.769) 7(-0.635,2.769) 8(-1.905,2.769)
  rect 3.2x2.4 smd: 9(0,0)
LED_0603
  rect 0.8x0.8 smd: 1(-0.851,-0.01) 2(0.75,-0.005)
LQFP-48_L7.0-W7.0-P0.50-LS9.0-BL
  oval 0.27x1.5 smd: 1(-2.75,-4.25) 2(-2.25,-4.25) 3(-1.75,-4.25) 4(-1.25,-4.25) 5(-0.75,-4.25) 6(-0.25,-4.25) 7(0.25,-4.25) 8(0.75,-4.25) 9(1.25,-4.25) 10(1.75,-4.25) 11(2.25,-4.25) 12(2.75,-4.25) 25(2.75,4.25) 26(2.25,4.25) 27(1.75,4.25) 28(1.25,4.25) 29(0.75,4.25) 30(0.25,4.25) 31(-0.25,4.25) 32(-0.75,4.25) 33(-1.25,4.25) 34(-1.75,4.25) 35(-2.25,4.25) 36(-2.75,4.25)
  oval 1.5x0.27 smd: 13(4.25,-2.75) 14(4.25,-2.25) 15(4.25,-1.75) 16(4.25,-1.25) 17(4.25,-0.75) 18(4.25,-0.25) 19(4.25,0.25) 20(4.25,0.75) 21(4.25,1.25) 22(4.25,1.75) 23(4.25,2.25) 24(4.25,2.75) 37(-4.25,2.75) 38(-4.25,2.25) 39(-4.25,1.75) 40(-4.25,1.25) 41(-4.25,0.75) 42(-4.25,0.25) 43(-4.25,-0.25) 44(-4.25,-0.75) 45(-4.25,-1.25) 46(-4.25,-1.75) 47(-4.25,-2.25) 48(-4.25,-2.75)
M3螺丝
  round 5 hole 5x3.2: 1(-0.064,0.064)
Pad_e5726
  round 1.016 smd far side: 49(0,0)
Pad_e5728
  round 1.016 smd far side: 49(0,0)
Pad_e5780
  round 1.016 smd far side: 49(0,0)
Pad_e5783
  round 1.016 smd far side: 49(0,0)
Pad_e5786
  round 1.016 smd far side: 49(0,0)
Pad_e5839
  round 1.016 smd far side: 49(0,0)
Pad_e5842
  round 1.016 smd far side: 49(0,0)
Pad_e5845
  round 1.016 smd far side: 49(0,0)
Pad_e5969
  round 1.016 smd far side: 49(0,0)
PG-DSO-8_L5.0-W4.0-P1.27-LS6.0-BL
  oval 0.602x1.885 smd: 1(-1.905,-2.743) 2(-0.635,-2.743) 3(0.635,-2.743) 4(1.905,-2.743) 5(1.905,2.743) 6(0.635,2.743) 7(-0.635,2.743) 8(-1.905,2.743)
R0402
  rect 0.566x0.54 smd: 1(-0.433,0) 2(0.433,0)
R1206
  rect 1.208x1.701 smd: 1(-1.479,0) 2(1.479,0)
SMA_L4.3-W2.6-LS5.2-RD
  rect 2x2 smd: 1(-2.2,0) 2(2.2,0)
SMD_L_4020
  rect 1.3x3.7 smd: 1(1.616,0.09) 2(4.616,0.09)
SOD-123F_L2.7-W1.6-LS3.8-RD
  rect 1.1x1 smd: 1(-1.735,0) 2(1.735,0)
SOT-23-5_L3.0-W1.7-P0.95-LS2.8-BL
  rrect 0.5x0.6 smd: 1(-0.95,-1.2) 2(0,-1.2) 3(0.95,-1.2) 4(0.95,1.2) 5(-0.95,1.2)
SOT-23-6_L2.9-W1.6-P0.95-LS2.8-BR
  rect 1.1x0.6 smd: 1(1.35,-0.95) 2(1.35,0) 3(1.35,0.95) 4(-1.35,0.95) 5(-1.35,0) 6(-1.35,-0.95)
SW-SMD_8P-L10.2-W6.2-P2.54-LS9.4
  rect 2x1.1 smd: 1(-4.5,3.81) 2(-4.5,1.27) 3(-4.5,-1.27) 4(-4.5,-3.81) 5(4.5,-3.81) 6(4.5,-1.27) 7(4.5,1.27) 8(4.5,3.81)
SW-SMD_L4.0-W2.9-P4.15-EH
  rect 1.35x1.8 smd: 1(-2.075,0) 2(2.075,0)
SW-SMD_TS24CA
  rect 0.9x1.2 smd: 1(-2.3,0.775) 2(2.3,0.775)
  rect 1.2x1.3 smd: 3(-1.675,-0.775) 4(1.675,-0.775)
USB-SMD_TYPE-C-16PQT-073
  rect 2x1.2 smd: 1(-5.325,1.825) 2(5.325,1.825)
  rect 2x1.5 smd: 3(5.325,-2.375) 4(-5.325,-2.375)
  rect 0.6x1.1 smd: A1B12(-3.2,2.375) A4B9(-2.4,2.375) B1A12(3.2,2.375) B4A9(2.4,2.375)
  rect 0.3x1.1 smd: A5(-1.25,2.375) A6(-0.25,2.375) A7(0.25,2.375) A8(1.25,2.375) B5(1.75,2.375) B6(0.75,2.375) B7(-0.75,2.375) B8(-1.75,2.375)

## Nets
As in the schematic, except:
DGND: C1.1 C3.1 C4.1 C5.1 C6.1 C7.1 C8.1 C9.2 C10.2 C11.2 C12.2 C13.1 C14.2 C15.2 C16.1 C17.1 CN1.5 CN1.6 CN2.1 CN2.5 CN2.6 D2.2 FPC1.3 FPC1.6 FPC1.9 FPC1.10 FPC1.11 FPC1.12 H1.2 H2.1 LED1.1 LED2.1 NOREF#6.49 NOREF#9.49 R3.2 R5.1 R6.2 R8.2 R14.2 R15.2 SW2.2 SW3.1 SW3.2 SW3.4 SW4.1 SW4.2 SW4.4 U1.1 U1.2 U1.3 U1.4 U1.A1B12 U1.B1A12 U2.2 U3.2 U4.7 U5.1 U5.9 U6.1 U6.9 U7.8 U7.23 U7.47
CSQ: NOREF#4.49 U4.3 U7.14
DATA: NOREF.49 R1.1 R2.1 U4.4
RX: FPC1.4 NOREF#5.49 U7.31
SCK: NOREF#8.49 U4.2 U7.15
SWCLK: FPC1.7 NOREF#7.49 U7.37
SWDIO: FPC1.8 NOREF#2.49 U7.34
TX: FPC1.5 NOREF#3.49 U7.30

Pads without a net: SCREW1 1; SCREW2 1; SCREW3 1; SCREW4 1; U1 A6 A7 A8 B6 B7 B8; U4 1 5 8; U7 2 3 4 5 6 21 25 26 27 28 29 32 33 35 36

## Via types
v1: diameter 0.61, hole 0.305, Top Layer to Bottom Layer, 38 vias
v2: diameter 0.508, hole 0.305, Top Layer to Bottom Layer, 3 vias
v3: diameter 0.559, hole 0.305, Top Layer to Bottom Layer, 125 vias

## Routing (per net, layer and track width the routed paths; a pad name or vN(x,y) marks a point on that pad's centre or on a via; arc(x,y) is an arc through that point)
3.3VD: length 34.4
  Top Layer w0.254: 12.71,16.95 12.76,16.95 v3(12.8,16.99) ; U7.9 23.39,13.96 C9.1 22.47,14.08 v2(22.45,14.07) ; U7.1 24.02,17.96 23.6,18.39 C10.1 24.4,19.37 v1(24.49,19.28) 25.16,19.28 C11.1 25.25,18.77 25.5,18.52 26.14,18.52 26.31,18.69 U7.48
  Top Layer w0.305: 31.71,9.58 31.91,9.37 v3(32.49,9.37) ; 31.71,9.58 31.51,9.37 31.51,8.24 R7.2 ; 31.71,9.58 31.81,9.67 U7.24
  Top Layer w0.381: v3(17.5,5.44) R11.2 R9.1
  Top Layer w0.508: v3(22.96,7.72) 22.93,7.69 CN2.4 ; C13.2 12.71,16.95
  Bottom Layer w0.305: 32.49,9.8 32.34,9.66 FPC1.1 ; 32.49,9.8 v3(32.49,9.37) ; 32.49,9.8 32.13,10.16 FPC1.2
  Bottom Layer w0.508: v3(32.49,9.37) 32.49,8.86 31.6,7.97 30.81,7.97 30.31,7.47 23.72,7.47 23.47,7.72 v3(22.96,7.72) ; v3(12.8,16.99) U4.6
  vias: v1(18.13,0.61) v1(18.9,2.26) v1(19.79,2.26) v1(19.79,0.74)
DGND: length 29.1
  Top Layer w0.254: U7.8 23.98,14.46 C9.2 v3(23.27,16.38) ; 30.17,9.37 C12.2 30.43,9.37 31.31,10.25 U7.23 31.31,12.55 ; C11.2 25.34,20.55 26.52,20.55 26.81,20.26 U7.47
  Top Layer w0.381: 33.52,21.44 33.25,21.44 33.12,21.31 C8.1
  Top Layer w0.508: 30.2,9.37 29.95,9.12 v3(29.95,8.74) ; 5.18,17.5 5.67,17.01 6.15,17.01 U1.A1B12 ; v3(11.66,19.15) C13.1 12.74,18.05 v3(12.93,18.24) ; U2.2 v3(9.5,18.39)
  Bottom Layer w0.254: v3(33.5,11.28) 32.89,10.66 FPC1.3 ; FPC1.9 FPC1.10 31.19,14.75 v3(31.19,14.76)
  Bottom Layer w0.305: FPC1.6 30.07,12.16 29.95,12.04 29.95,10.9 30.18,10.66 FPC1.3
  Bottom Layer w0.381: 34.42,18.32 34.42,18.01 SW4.1
  Bottom Layer w0.508: v3(12.93,18.24) 12.95,18.26 U4.7 ; FPC1.11 34.02,16.1 SW4.1 ; v3(14.99,28.67) U6.9
  vias: v1(12.29,7.85) v1(24.36,20.55) v1(30.2,25.25) v1(31.09,25.25) v1(31.98,25.25) v3(0.86,25.5) v3(1.12,6.83) v3(1.24,32.87) v3(1.82,25.51) v3(2.01,0.99) v3(2.39,34.01) v3(2.64,25.5) v3(3.4,17.88) v3(3.66,15.85) v3(3.78,25.5) v3(3.78,15.09) v3(4.8,34.14) v3(5.18,17.5) v3(5.16,10.64) v3(5.61,19.14) v3(5.94,0.86) v3(7.19,10.64) v3(7.57,34.14) v3(8.15,6.12) v3(8.28,7.29) v3(8.53,18.36) v3(8.86,6.17) v3(9.17,34.14) v3(10.46,18.39) v3(10.64,30.2) v3(10.59,28.35) v3(10.96,22.96) v3(11.34,29.29) v3(11.66,20.04) v3(12.04,22.96) v3(12.09,30.12) v3(12.09,28.47) v3(12.29,8.78) v3(12.29,6.96) v3(14.2,5.18) v3(14.84,30.29) v3(14.86,10.08) v3(15.09,5.18) v3(17.37,4.42) v3(17.5,30.33) v3(17.5,28.39) v3(17.5,23.86) v3(17.51,19.64) v3(17.5,18.1) v3(17.5,15.85) v3(17.5,9.96) v3(20.95,29.21) v3(21.25,30.32) v3(21.98,20.29) v3(22.93,3.89) v3(23.54,28.24) v3(23.57,30.2) v3(24.07,29.29) v3(24.22,26.73) v3(24.54,30.23) v3(24.54,28.23) v3(28.42,34.01) v3(28.42,2.01) v3(28.42,0.74) v3(29.29,25.25) v3(31.04,26.72) v3(32.01,15.89) v3(32.87,34.14) v3(33.25,0.86) v3(33.38,9.5) v3(33.63,21.44) v3(34.14,29.31) v3(34.14,1.88) v3(34.26,32.99) v3(34.42,18.34) v3(34.39,9.5) v3(34.39,5.56) v3(34.39,3.5)
VIN: length 1.7
  Top Layer w0.381: 9.98,8.69 9.98,8.08 10.24,7.82 10.26,7.85 U3.5
  vias: v3(1.14,21.18) v3(2.31,20.6) v3(3.53,21.18) v3(3.53,20.01) v3(6.45,23.88) v3(7.21,22.83) v3(7.19,9.93) v3(7.19,9.25) v3(7.19,8.56) v3(7.19,7.8) v3(7.34,23.88) v3(8.28,23.88) v3(25.7,25.32) v3(26.59,25.32) v3(27.43,25.3) v3(28.22,25.3)
A+:
  vias: v1(19.91,32.87) v1(19.98,31.5)
A-:
  vias: v1(22.45,32.87) v1(22.52,31.42)
B+:
  vias: v1(13.56,32.87) v1(13.56,31.51)
B-:
  vias: v1(16.1,32.99) v1(16.1,31.49)
CAL: length 3.7
  Top Layer w0.254: U7.10 23.7,13.46 23.24,13 SW1.4
CC1: length 4.1
  Top Layer w0.254: U1.A5 6.83,15.07 7.09,15.32 7.09,16.74 7.54,17.19 U2.4
CC2: length 8.5
  Top Layer w0.254: U2.5 9.62,16.36 7.97,16.36 7.59,15.98 7.59,12.42 7.24,12.07 U1.B5
CLKIN: length 39.8
  Top Layer w0.254: v3(25.32,11.76) 25.32,7.72 22.79,5.19 CN2.2 ; v1(28.73,9.6) 28.81,9.68 U7.18
  Bottom Layer w0.254: 25.09,11.2 4.92,11.2 2.84,9.12 H2.4 ; 25.09,11.2 25.32,11.43 v3(25.32,11.76) ; 25.09,11.2 27.13,11.2 v1(28.73,9.6)
CSQ: length 11.2
  Top Layer w0.254: v1(26.9,14.07) 26.81,13.98 U7.14
  Bottom Layer w0.254: U4.3 NOREF#4.49 24.36,16.99 26.9,14.45 v1(26.9,14.07)
DATA: length 14.4
  Top Layer w0.254: R2.1 R1.1 26.39,7.8 25.88,8.3 25.88,11.81 26.14,12.06 v1(26.14,14.07)
  Bottom Layer w0.254: v1(26.14,14.07) 24.49,15.72 NOREF.49 U4.4
DIRIN: length 38
  Top Layer w0.254: v1(27.91,12.29) 28.93,12.29 29.31,11.92 U7.19 ; CN2.3 23.18,6.44 24.94,8.2 24.94,11.33 v3(24.41,11.86)
  Bottom Layer w0.254: v1(27.91,12.29) 27.89,12.32 24.87,12.32 v3(24.41,11.86) 23.67,12.6 4.98,12.6 4.04,11.66 H2.3
ENIN: length 29.7
  Top Layer w0.254: v1(27.97,13.18) 28.8,13.18 29.81,12.18 U7.20
  Bottom Layer w0.254: v1(27.97,13.18) 4.57,13.18 3.56,14.2 H2.2
IN1: length 13.6
  Top Layer w0.254: U7.43 28.81,20.49 28.29,21 v1(28.29,21.18)
  Bottom Layer w0.254: U5.3 19.98,24.8 20.68,24.1 25.37,24.1 v1(28.29,21.18)
IN2: length 13
  Top Layer w0.254: v1(29.06,21.18) 29.31,20.93 U7.42
  Bottom Layer w0.254: v1(29.06,21.18) 29.06,21.69 26.14,24.61 21.82,24.61 21.25,25.18 U5.2
IN3: length 18.7
  Top Layer w0.254: v1(26.52,21.18) 27.31,20.39 U7.46
  Bottom Layer w0.254: v1(26.52,21.18) 25.25,22.45 15.34,22.45 13.57,24.22 U6.3
IN4: length 17.9
  Top Layer w0.254: v1(27.41,21.18) 27.81,20.78 U7.45
  Bottom Layer w0.254: U6.2 14.84,24.86 16.48,23.22 25.5,23.22 27.41,21.31 v1(27.41,21.18)
K1: length 9.1
  Top Layer w0.254: C7.2 33.97,25.72 v1(34.01,25.75) ; U7.39 v1(30.81,22.83)
  Bottom Layer w0.254: v1(34.01,25.75) 33.38,25.75 32.47,24.85 SW3.3 31.23,22.83 v1(30.81,22.83)
K2: length 7.2
  Top Layer w0.254: U7.38 31.31,20.35 31.45,20.49 32.1,20.49 32.36,20.24 32.36,19.79 32.49,19.66 33.08,19.66 C8.2 33.13,19.62 33.43,19.91 v1(34.01,19.91)
  Bottom Layer w0.254: v1(34.01,19.91) 33.12,19.91 32.49,19.28 32.49,18.25 SW4.3
LED: length 16.5
  Top Layer w0.254: v3(27.18,5.84) 27.91,6.58 27.94,6.58 28.55,7.19 28.55,8.6 29.87,9.92 30.47,9.92 30.81,10.26 U7.22 ; v3(18.74,5.38) 18.77,5.41 R10.2
  Bottom Layer w0.254: v3(18.74,5.38) 26.72,5.38 v3(27.18,5.84)
MISO: length 2.8
  Top Layer w0.254: U7.16 27.81,10.18 26.64,9.02 R1.2
MOSI: length 2.6
  Top Layer w0.254: R2.2 27.59,9.3 28.31,10.02 U7.17
NRST: length 15.9
  Top Layer w0.254: v1(28.55,14.96) 28.54,14.96 U7.7 ; v1(29.18,8.36) 29.44,8.1 R7.1 30.78,7.95 31.69,7.04 33.63,7.04
  Bottom Layer w0.254: v1(28.55,14.96) 28.68,14.83 28.68,12.95 29.41,12.22 29.41,9.22 29.18,8.99 v1(29.18,8.36)
OPCL: length 7.8
  Top Layer w0.254: U7.11 23.7,12.96 22.46,11.72 18.83,11.72 18.77,11.78 SW1.3
PWM1: length 10.2
  Top Layer w0.254: R13.2 23.9,23.16 24.23,22.83 29.82,22.83 30.31,22.35 U7.40
PWM2: length 8.1
  Top Layer w0.254: R12.2 29.55,21.82 29.81,21.56 U7.41
RX: length 7.6
  Top Layer w0.254: U7.31 34.22,15.46 34.42,15.27 v2(34.42,12.72)
  Bottom Layer w0.254: FPC1.4 32.24,11.16 NOREF#5.49 33.81,12.72 v2(34.42,12.72)
SCK: length 12.8
  Top Layer w0.254: U7.15 27.31,13.59 v1(27.79,14.07)
  Bottom Layer w0.254: v1(27.79,14.07) 27.79,14.45 23.98,18.26 NOREF#8.49 U4.2
SET1: length 16.2
  Top Layer w0.254: v3(26.54,9.78) 26.31,10.01 U7.13 ; v3(20.5,10.24) 19.74,11 14.48,11 13.69,11.78 SW1.1
  Bottom Layer w0.254: v3(26.54,9.78) 26.09,10.24 v3(20.5,10.24)
SET2: length 10.1
  Top Layer w0.254: v3(23.65,11.78) 23.65,12.14 23.97,12.46 U7.12 ; SW1.2 17.17,13 17.5,12.67 v3(17.5,11.84)
  Bottom Layer w0.254: 17.45,11.76 17.47,11.78 v3(23.65,11.78)
SWCLK: length 9.2
  Top Layer w0.254: v3(31.22,17.37) 31.22,17.5 31.81,18.09 U7.37
  Bottom Layer w0.254: v3(31.22,17.37) 29.44,15.59 29.44,13.18 29.96,12.66 FPC1.7
SWDIO: length 7.1
  Top Layer w0.254: U7.34 32.01,16.96 v3(31.98,16.99)
  Bottom Layer w0.254: v3(31.98,16.99) 29.94,14.96 29.94,13.46 30.25,13.16 FPC1.8
TX: length 5.5
  Top Layer w0.254: U7.30 32.13,14.96 v2(32.1,14.93)
  Bottom Layer w0.254: v2(32.1,14.93) 32.28,14.76 32.28,11.91 32.03,11.66 31.19,11.66 FPC1.5
V_USB: length 17.8
  Top Layer w0.508: 4.8,15.72 5.31,16.23 ; 4.8,15.72 v3(4.8,15.21) v3(4.8,14.4) 4.8,11.92 5.31,11.42 U1.B4A9 ; 4.8,15.72 4.42,16.1 4.42,21.06 5.49,22.12 R4.1 ; 5.31,16.22 U1.A4B9
  vias: v3(5.26,16.2) v3(11.15,15.57) v3(11.15,14.86) v3(11.18,14.05)
VREF1: length 8.8
  Top Layer w0.254: v1(18.77,24.1) 19.15,23.72 R13.1 23.05,23.74 C17.2
  Bottom Layer w0.254: v1(18.77,24.1) 18.71,24.17 U5.4
VREF2: length 17.2
  Top Layer w0.254: v1(22.58,21.06) 23.04,21.51 R12.1 ; v1(12.29,24.99) 11.15,24.99 10.86,24.7 C16.2
  Bottom Layer w0.254: v1(22.58,21.06) 21.94,21.69 14.96,21.69 12.29,24.36 v1(12.29,24.99) 12.29,26.67 U6.4
$1N1812: length 10.2
  Top Layer w0.254: v1(31.98,22.71) 31.98,22.58 R6.1 ; U7.44 v1(28.31,18.14)
  Bottom Layer w0.254: v1(31.98,22.71) 31.66,22.71 31.18,22.23 31.18,18.86 30.45,18.14 v1(28.31,18.14)
$1N2583: length 9.7
  Top Layer w0.508: R3.1 12.5,21.26 13.24,22 SW1.8 SW1.7 SW1.6 SW1.5
$1N3189: length 3.4
  Top Layer w0.254: C1.2 8.51,19.55 U2.3 8.55,19.98 9.37,20.8 R4.2
$1N3458: length 1.7
  Top Layer w0.254: R5.2 10.64,20.29 10.45,20.1 U2.1
$1N3955: length 1.8
  Top Layer w0.508: C2.1 12.84,6.15 13.58,6.9 U3.1
$1N4403: length 3.9
  Top Layer w0.254: R9.2 R8.1 14.96,8.23 14.39,8.8 U3.3
$1N5172: length 2.4
  Top Layer w0.381: LED2.2 17.11,8.5 17.5,8.1 R11.1
$1N5198: length 1.4
  Top Layer w0.381: R10.1 18.77,8.49 18.76,8.5
$1N7717: length 1
  Top Layer w0.508: v3(7.97,32.11) v3(8.94,32.11) 8.99,32.05
  vias: v3(14.83,32.99) v3(14.83,31.72)
$1N7720:
  vias: v3(21.21,32.9) v3(21.31,31.6) v3(27.41,33.38) v3(27.91,32.61)

## Copper pours and planes (outline as drawn; the poured copper is in the pictures)
3.3VD on Top Layer: 13.44,4.42 14.71,4.42 15.52,3.61 15.52,3.16 15.81,2.87 18.31,2.87 18.51,2.67 19.76,2.67 20.29,2.13 20.29,0.37 13.58,0.37 13.44,0.23
3.3VD on Inner1: 20.17,0.23 20.8,0.86 20.8,7.47 24.87,7.47 24.87,19.41 24.56,19.79 23.34,19.79 21.31,17.75 12.04,17.75 12.04,13.18 15.5,9.72 15.5,0.45 15.72,0.23
DGND on Top Layer: 33.8,22.31 33.8,23.12 33.36,23.56 26.83,23.56 24.73,25.5 24.49,25.5 24.49,24.99 23.85,24.99 23.72,25.12 23.72,26.67 23.14,27.25 23.14,33.5 21.82,33.5 21.82,29.54 20.95,28.68 20.68,28.68 20.55,28.8 20.55,32.99 20.17,33.38 19.15,33.38 19.01,33.24 19.01,29.29 18.13,28.41 18.13,27.91 18.01,27.79 17.25,27.79 16.99,28.04 16.99,33.38 16.87,33.5 15.85,33.5 15.56,33.22 15.56,27.79 14.96,27.79 14.55,28.2 14.55,30.58 14.2,30.93 14.2,33.38 13.94,33.63 13.18,33.63 13.06,33.5 13.06,28.87 11.85,27.66 11.02,27.66 9.75,26.39 9.75,24.99 9.37,24.61 5.56,24.61 4.17,23.22 0,23.22 0,33.53 1.5,35.03 1.52,35 35.5,35 35.5,26.39 32.43,26.39 32.43,25.23 32.75,24.91 33.45,24.91 34.78,23.57 34.78,22.42 34.67,22.31
DGND on Top Layer: 25.25,18.77 32.61,18.77 32.61,12.04 25.25,12.04
DGND on Top Layer: 12.04,6.7 12.04,9.34 12.63,9.93 12.67,9.93 12.67,10.64 11.66,11.66 11.66,15.34 11.72,15.4 10.9,16.23 10.9,17.25 10.51,17.63 7.09,17.63 6.83,17.88 6.83,18.77 6.96,18.9 10.51,18.9 10.9,19.28 10.9,20.55 11.15,20.8 25.5,20.8 25.5,20.17 25.37,20.04 23.34,20.04 23.21,19.91 23.21,18.27 23.85,17.63 23.85,15.21 23.27,14.63 13.06,14.63 13.06,11.53 14.07,10.52 19.53,10.52 20.17,11.15 24.61,11.15 24.61,8.99 22.2,8.99 21.69,8.48 20.11,8.48 18.97,9.63 14.2,9.63 14.2,7.47 13.18,7.47 12.8,7.09 12.8,6.7
DGND on Top Layer: 4.29,23.22 4.29,11.28 4.55,11.02 7.34,11.02 7.59,10.77 7.59,10.39 7.47,10.26 6.96,10.26 6.45,9.75 6.45,7.47 6.71,7.21 7.72,7.21 8.61,8.1 9.5,8.1 10.01,7.59 10.01,4.17 6.07,0.23 -0.03,0.23 -0.03,22.58 0.61,23.22
DGND on Top Layer: 35.15,1.75 33.63,0.23 20.8,0.23 20.42,0.61 20.42,2.26 19.66,3.02 17.1,3.02 16.68,3.44 15.81,3.44 15.72,3.53 15.72,4.57 15.49,4.8 13.82,4.8 13.82,6.32 13.94,6.45 15.29,6.45 16.05,5.69 18.01,5.69 19.28,4.42 20.17,4.42 20.17,4.29 22.07,4.29 22.33,4.55 22.83,4.55 25.75,7.47 35.15,7.47
DGND on Top Layer: 11.66,24.23 10.39,22.96 10.39,22.2 10.77,21.82 12.18,21.82 13.06,22.69 13.06,23.22 17.1,23.22 17.99,24.1 17.99,30.46 14.71,30.46 14.32,30.08 14.32,24.23
DGND on Bottom Layer: 9.25,35 9.25,34.9 9.75,34.39 9.75,33.88 5.69,29.82 5.69,23.22 5.31,22.83 0.99,22.83 0.35,23.47 0.35,33.43 1.83,34.9 2.01,34.9 2.11,35
DGND on Bottom Layer: 0.23,1.62 1.62,0.23 33.38,0.23 34.77,1.62 34.77,11.15 34.26,11.66 33.5,11.66 32.99,11.15 3.53,11.15 0.23,7.85
DGND on Bottom Layer: 12.04,13.82 11.66,14.2 11.66,15.98 11.02,16.61 4.29,16.61 4.29,14.96 4.16,14.83 3.53,14.83 2.39,15.98 0.48,15.98 0.35,16.1 0.35,18.64 1.23,19.52 6.31,19.52 8.74,21.94 8.74,28.8 10.34,30.4 10.34,30.58 20.42,30.58 20.42,30.7 21.83,30.7 21.94,30.58 24.59,30.58 25.09,30.07 25.09,28.42 24.99,28.32 24.99,26.01 24.61,25.63 22.58,25.63 22.2,26.01 22.2,27.83 22.13,27.89 19,27.89 18.49,27.38 18.49,23.6 16.87,23.6 15.85,24.61 15.85,27.53 15.49,27.89 11.91,27.89 11.91,24.23 15.09,21.06 29.44,21.06 29.44,22.33 27.03,24.74 27.03,33.76 28.04,34.77 33.38,34.77 34.77,33.38 34.77,21.56 34.52,21.31 30.96,21.31 30.96,19.02 30.58,18.64 21.94,18.64 20.95,19.64 19.28,19.64 19.28,14.2 18.9,13.82
DGND on Inner1: -0.66,35.66 35.28,35.66 35.28,-0.15 -0.66,-0.15
DGND on Inner2: -0.53,35.53 35.79,35.53 35.79,-0.66 -0.53,-0.66
VIN on Top Layer: 8.2,11.48 8.2,11.61 11.75,11.61 12.16,11.2 12.16,9.92 10.69,8.46 9.63,8.46 9.5,8.33 8.58,8.33 7.65,7.39 6.58,7.39 6.55,7.42 6.55,9.83
VIN on Top Layer: 24.76,23.49 28.32,23.49 28.5,23.67 28.5,25.5 28.22,25.78 25.11,25.78 24.76,25.44
VIN on Bottom Layer: 8.48,28.78 8.48,23.16 6.1,23.16 6.07,23.19 6.07,29.82 11.3,35.05 25.58,35.05 27.2,33.43 27.2,27.11 28.46,25.68 28.45,24.82 25.25,24.82 25.25,30.94 23.24,32.94 19.1,32.94 19.1,31.27 19.02,31.19 17.22,31.19 16.69,31.72 16.69,33.43 13.16,33.43 12.65,32.92 12.65,31.19 12.22,30.76 10.46,30.76
VIN on Bottom Layer: 8.48,25.37 8.48,22.2 6.06,19.78 0.75,19.78 0.61,19.91 0.61,21.44 0.74,21.56 4.42,21.56 5.94,23.09 5.94,24.87 6.45,25.37
VIN on Inner1: 7.95,10.06 7.95,7.35 1.51,7.35 0.2,8.66 0.2,20.55 2.32,22.67 5.4,22.67 6.04,23.32 6.04,24.54 9.57,24.54 9.63,24.48 9.63,23.19 6.96,20.52 4.47,20.52 2.58,18.63 2.58,11.01 3.36,10.23 7.78,10.23
A+ on Top Layer: 19.15,29.06 18.13,28.04 18.13,24.74 19.53,24.74 19.53,27.88 20.42,28.77 20.42,33.12 20.29,33.25 19.41,33.25 19.15,32.99
A- on Top Layer: 21.82,29.31 20.55,28.04 20.55,24.61 21.94,24.61 21.94,27.73 23.02,28.8 23.02,33.19 22.83,33.38 22.07,33.38 21.82,33.12
B+ on Top Layer: 14.45,24.61 14.45,30.5 13.99,30.97 13.99,33.2 13.82,33.38 13.31,33.38 13.06,33.12 13.06,24.61
B- on Top Layer: 15.59,32.99 15.59,24.61 17,24.61 17,33.11 16.74,33.38 15.98,33.38
V_USB on Top Layer: 8.2,16 11.08,16 11.51,15.57 11.51,14.04 11.18,13.7 8.37,13.7 8.2,13.87
V_USB on Bottom Layer: 11.46,13.84 4.82,13.84 4.38,14.29 4.38,16.48 10.97,16.48 11.46,16
$1N3959 on Top Layer: 11.53,7.21 12.04,6.7 12.04,0.75 11.52,0.23 7.97,0.23 7.72,0.48 7.72,2.13 10,4.41 10,7.11 10.1,7.21
$1N7717 on Inner1: 7.97,30.96 14.83,30.96 15.47,31.6 15.47,34.39 15.09,34.77 7.81,34.77 7.57,34.53 7.57,31.37
$1N7720 on Top Layer: 25.63,31.6 27.63,31.6 28.22,32.19 28.22,33.29 27.75,33.92 26.18,33.92 25.63,33.38
$1N7720 on Inner1: 26.64,30.58 28.68,32.61 28.68,34.52 28.42,34.77 20.93,34.77 20.68,34.52 20.68,31.47 21.56,30.58

Small or netless copper shapes (teardrops, artwork), in the pictures only: 3 on Bottom Layer

## Text on the board
Bottom Silkscreen Layer: SCK | CSQ | DATA | G | CLK | -4 | -8 | DIO | T | R | - | + | DIR | EN
Top Silkscreen Layer: B+ | B- | A+ | A- | DIR | CLK | 细分2 | 闭环 | 校正 | 细分1
